# EAGLE design AD_IanFritz (EAGLE 9.6.2)
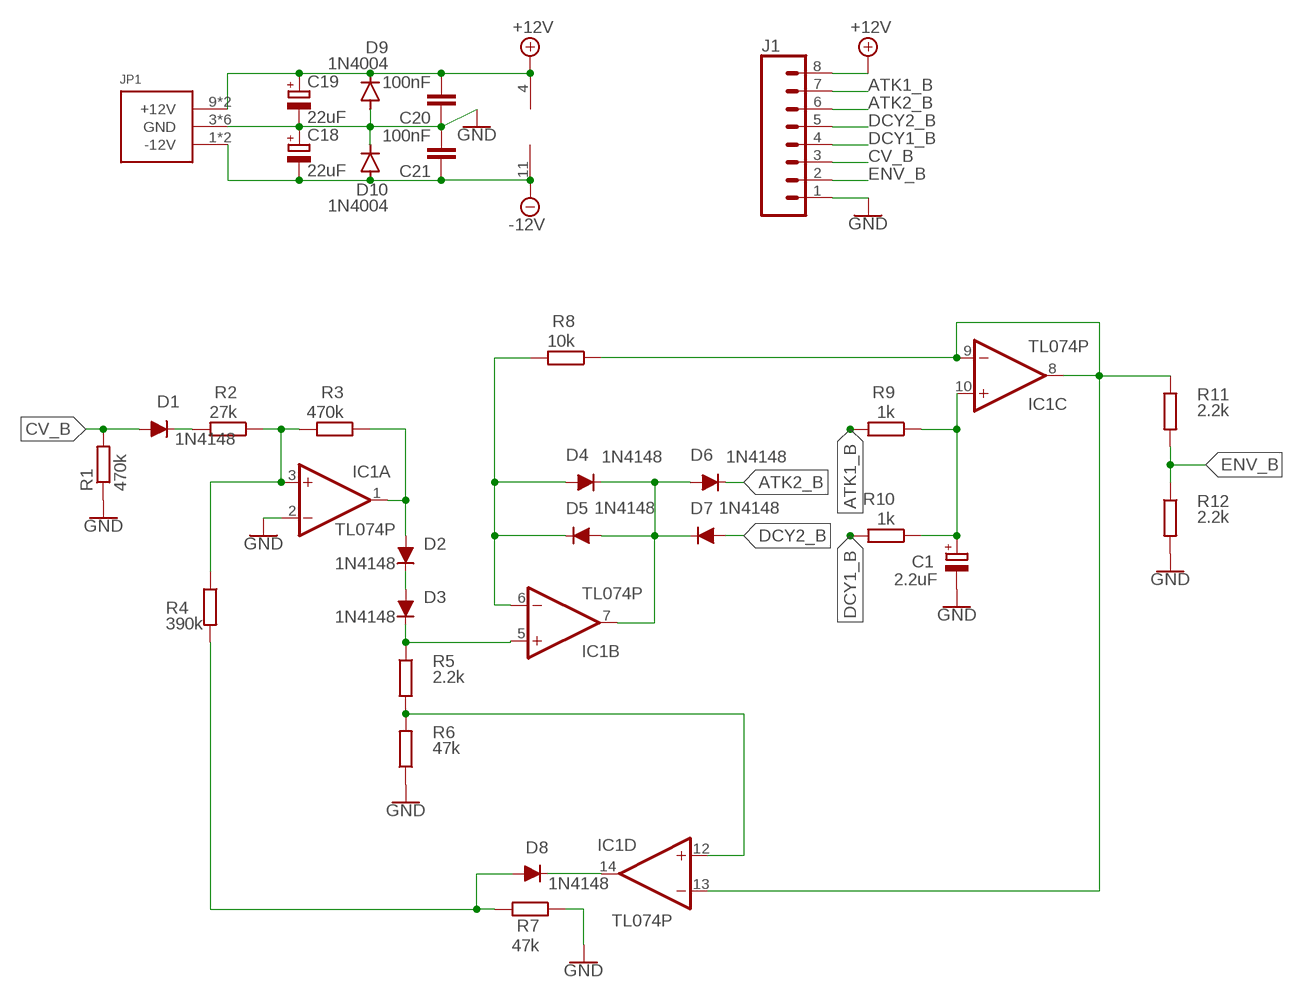
[diagram p0: schematic, sheet 1]

## Parts
C1  2.2uF  CPOL-EUE2-4  [E2-4]
C18  22uF  CPOL-EUE2-4  [E2-4]
C19  22uF  CPOL-EUE2-4  [E2-4]
C20  100nF  C2,5-3  [C2.5-3]
C21  100nF  C2,5-3  [C2.5-3]
D1  1N4148  DIODED0-35  [DO-35]
D2  1N4148  DIODED0-35  [DO-35]
D3  1N4148  DIODED0-35  [DO-35]
D4  1N4148  DIODED0-35  [DO-35]
D5  1N4148  DIODED0-35  [DO-35]
D6  1N4148  DIODED0-35  [DO-35]
D7  1N4148  DIODED0-35  [DO-35]
D8  1N4148  DIODED0-35  [DO-35]
D9  1N4004  [DO41-10]
D10  1N4004  [DO41-10]
IC1  TL074P  [DIL14]
J1  CONN_08"  [1X08]
JP1  POWER_SIMPLE10  [POWER_10]
R1  470k  RESISTOR7MM  [7MM_RESISTOR]
R2  27k  RESISTOR7MM  [7MM_RESISTOR]
R3  470k  RESISTOR7MM  [7MM_RESISTOR]
R4  390k  RESISTOR7MM  [7MM_RESISTOR]
R5  2.2k  RESISTOR7MM  [7MM_RESISTOR]
R6  47k  RESISTOR7MM  [7MM_RESISTOR]
R7  47k  RESISTOR7MM  [7MM_RESISTOR]
R8  10k  RESISTOR7MM  [7MM_RESISTOR]
R9  1k  RESISTOR7MM  [7MM_RESISTOR]
R10  1k  RESISTOR7MM  [7MM_RESISTOR]
R11  2.2k  RESISTOR7MM  [7MM_RESISTOR]
R12  2.2k  RESISTOR7MM  [7MM_RESISTOR]

## Nets
+12V [power]: C19.+ C20.2 D9.C IC1.4(P:V+) J1.8 JP1.9(+12V) JP1.10(+12V)
-12V [power]: C18.- C21.1 D10.A IC1.11(P:V-) JP1.1(-12V) JP1.2(-12V)
ATK1_B: J1.7 R9.2
ATK2_B: D6.C J1.6
CV_B: D1.A J1.3 R1.2
DCY1_B: J1.4 R10.2
DCY2_B: D7.A J1.5
ENV_B: J1.2 R11.2 R12.1
GND: C1.- C18.+ C19.- C20.1 C21.2 D9.A D10.C IC1.2(A:-IN) J1.1 JP1.3(GND) JP1.4(GND) JP1.5(GND) JP1.6(GND) JP1.7(GND) JP1.8(GND) R1.1 R6.1 R7.1 R12.2
N$1: D3.C IC1.5(B:+IN) R5.1
N$2: D1.C R2.2
N$3: IC1.3(A:+IN) R2.1 R3.2 R4.1
N$6: D2.A IC1.1(A:OUT) R3.1
N$7: D2.C D3.A
N$9: IC1.12(D:+IN) R5.2 R6.2
N$10: D4.A D5.C IC1.6(B:-IN) R8.2
N$12: D4.C D5.A D6.A D7.C IC1.7(B:OUT)
N$14: D8.A R4.2 R7.2
N$15: D8.C IC1.14(D:OUT)
N$16: IC1.8(C:OUT) IC1.9(C:-IN) IC1.13(D:-IN) R8.1 R11.1
N$19: C1.+ IC1.10(C:+IN) R9.1 R10.1

## Library data of the parts
C1 C18 C19 = rcl:CPOL-EU: POLARIZED CAPACITOR, European symbol; SPICEPREFIX: C
C20 C21 = capacitor-wima:C: CAPACITOR naming: grid - package width
D1-D8 = x0x_pacemaker:DIODE
D9 D10 = diode:1N4004: DIODE general purpose rectifier, 1 A
IC1 = linear:TL074: OP AMP
J1 = SparkFun-Connectors:CONN_08: Multi connection point. Often used as Generic Header-pin footprint for 0.1 inch spaced/style header connections On any of the 0.1 inch spaced packages, you can populate with these: Break Away Headers - Straight <https://www.sparkfun.com/products/116> (PRT-00116) Break Away Male Headers - Right Angle <https://www.sparkfun.com/products/553> (PRT-00553) Female Headers <https://www.sparkfun.com/products/115> (PRT-00115) Break Away Headers - Machine Pin <https://www.sparkfun.com/products/117> (PRT-00117) Break Away Female Headers - Swiss Machine Pin <https://www.sparkfun.com/products/743> (PRT-00743) Arduino Stackable Header - 8 Pin <https://www.sparkfun.com/products/9279> (PRT-09279) For SCREWTERMINALS and SPRING TERMINALS visit here: Screw Terimnals on SparkFun.com <https://www.sparkfun.com/search/results?term=Screw+Terminals> (5mm/3.5mm/2.54mm spacing) This device is also useful as a general connection point to wire up your design to another part of your project. Our various solder wires solder well into these plated through hole pads. Hook-Up Wire - Assortment (Stranded, 22 AWG) <https://www.sparkfun.com/products/11375> (PRT-11375) Hook-Up Wire - Assortment (Solid Core, 22 AWG) <https://www.sparkfun.com/products/11367> (PRT-11367) View the entire wire category on our website here <https://www.sparkfun.com/categories/141> Special notes: Molex polarized connector foot print use with SKU : PRT-08231 with associated crimp pins and housings. 1MM SMD Version SKU: PRT-10208 NOTES ON THE VARIANTS LOCK and LOCK_LONGPADS... This footprint was designed to help hold the alignment of a through-hole component (i.e. 6-pin header) while soldering it into place. You may notice that each hole has been shifted either up or down by 0.005 of an inch from it's more standard position (which is a perfectly straight line). This slight alteration caused the pins (the squares in the middle) to touch the edges of the holes. Because they are alternating, it causes a "brace" to hold the component in place. 0.005 has proven to be the perfect amount of "off-center" position when using our standard breakaway headers. Although looks a little odd when you look at the bare footprint, once you have a header in there, the alteration is very hard to notice. Also,if you push a header all the way into place, it is covered up entirely on the bottom side.; PROD_ID: CONN-08438
JP1 = russ_eurorack:POWER_SIMPLE
R1-R12 = MusicThingModular:RESISTOR: Standard resistor, various versions

## Net classes
0 default: width 0.203 mm
1 power: width 0.406 mm

## Board
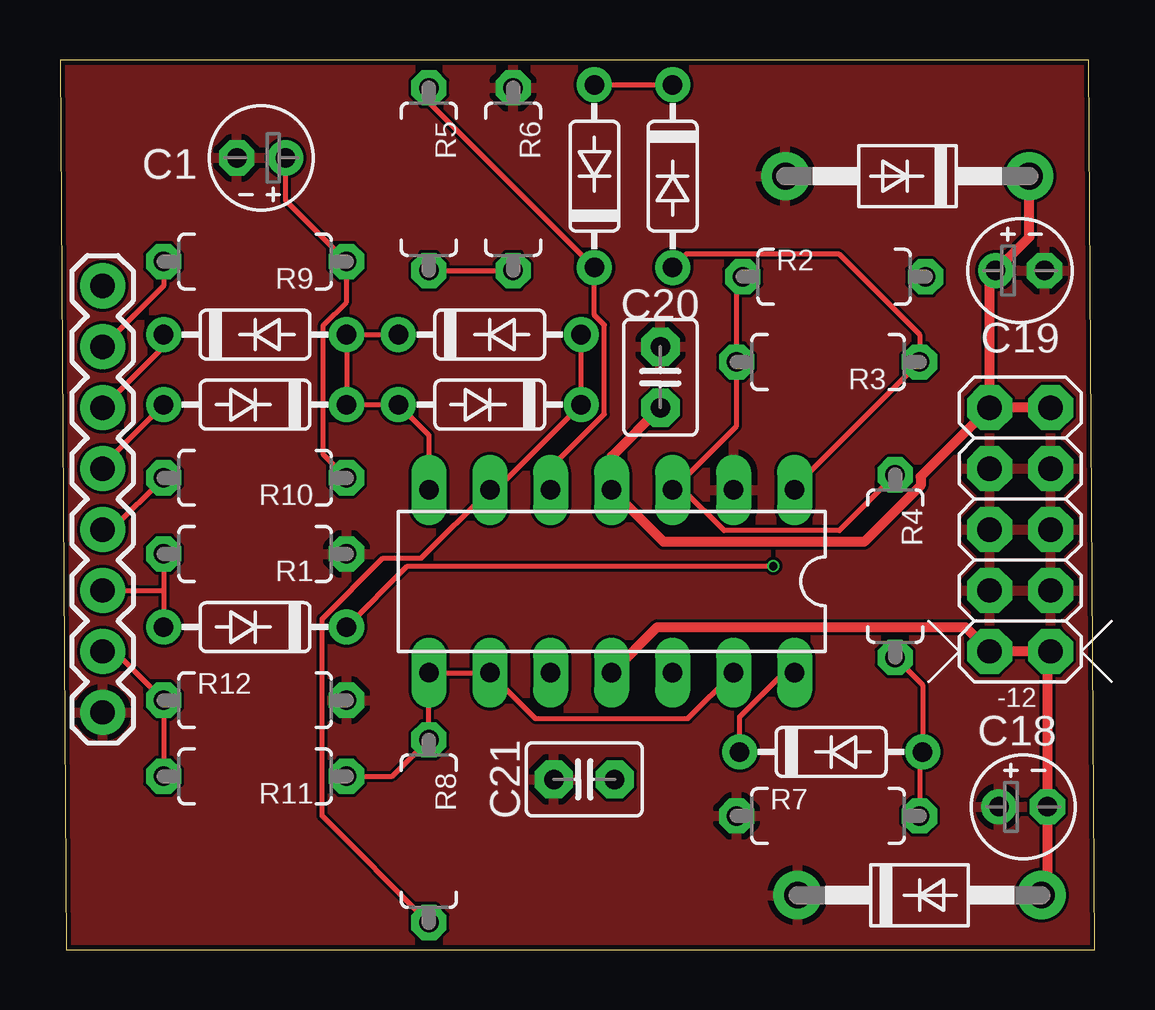
[diagram p1: board, top side]
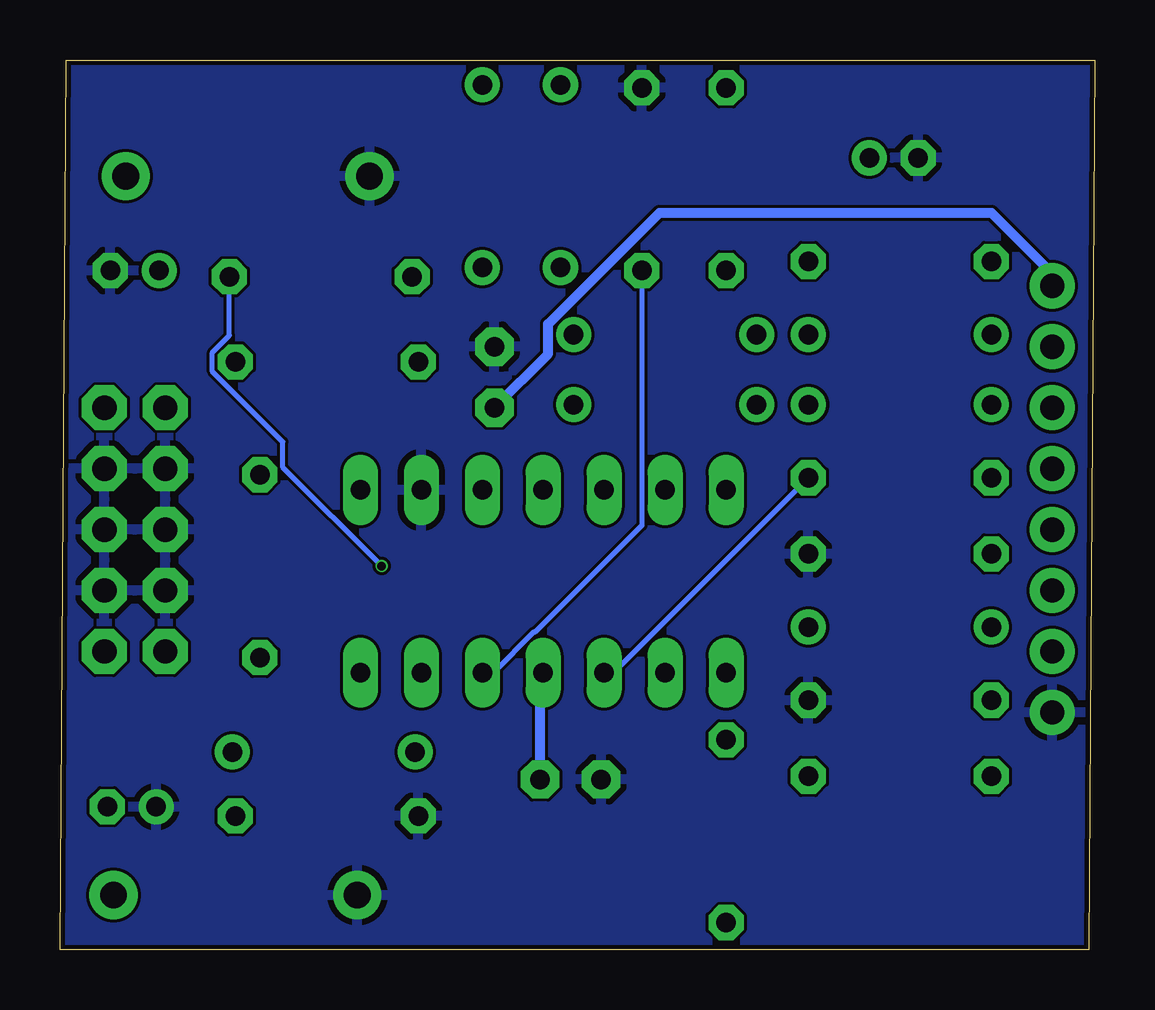
[diagram p2: board, bottom side, seen from below]

Size 43.12 x 37.1 mm. Coordinates in mm from the lower left corner, seen from the top.
Outline: 0.25,0 43.12,0 42.87,37.1 0,37.1 0.25,0
Copper layers (1*16): Top 0.035mm / dielectric 1.6mm / Bottom 0.035mm
Design rules "jlcpcb-2layers": minimum track width 5mil, minimum drill 0.3mm, track to track 5mil, track to pad 5mil, pad to pad 5mil, via to via 5mil, smd to smd 5mil, copper to edge 0.2mm, drill to drill 6mil, minimum pad ring 10mil, minimum via ring 3mil, stop-mask expansion 4mil, vias tented up to drill 0mil, thermal gap 10mil

### Footprints (pad centres in the part's own frame; a part is rotated, then mirrored left to right if it is on the bottom)
E2-4 = drill 0.813 pad 1.27: + -1.016,0 | drill 0.813 pad 1.27 octagon: - 1.016,0
C2.5-3 = drill 0.813 pad 1.6 octagon: 1 -1.27,0; 2 1.27,0
DO-35 = drill 0.813 pad 1.321: A 3.81,0; C -3.81,0
DO41-10 = drill 1.118: A 5.08,0; C -5.08,0
DIL14 = drill 0.813 long: 1 -7.62,-3.81; 2 -5.08,-3.81; 3 -2.54,-3.81; 4 0,-3.81; 5 2.54,-3.81; 6 5.08,-3.81; 7 7.62,-3.81; 8 7.62,3.81; 9 5.08,3.81; 10 2.54,3.81; 11 0,3.81; 12 -2.54,3.81; 13 -5.08,3.81; 14 -7.62,3.81
1X08 = drill 1.016 pad 1.88: 1 0,0; 2 2.54,0; 3 5.08,0; 4 7.62,0; 5 10.16,0; 6 12.7,0; 7 15.24,0; 8 17.78,0
POWER_10 = drill 1.016 pad 1.88 octagon: 1 -5.08,-1.27; 2 -5.08,1.27; 3 -2.54,-1.27; 4 -2.54,1.27; 5 0,-1.27; 6 0,1.27; 7 2.54,-1.27; 8 2.54,1.27; 9 5.08,-1.27; 10 5.08,1.27
7MM_RESISTOR = drill 0.813 octagon: 1 -3.81,0; 2 3.81,0

### Placement (x,y rotation side)
C1  8.38,33.02 180 top
C18  40.13,5.97 0 top
C19  40.01,28.32 0 top
C20  25.02,23.88 270 top
C21  21.84,7.11 180 top
D1  8.13,13.46 180 top
D2  25.53,32.26 270 top
D3  22.27,32.26 90 top
D4  17.91,25.65 0 top
D5  17.91,22.73 180 top
D6  8.13,25.65 0 top
D7  8.13,22.73 180 top
D8  32.13,8.25 0 top
D9  35.31,32.26 180 top
D10  35.81,2.29 0 top
IC1  22.99,15.37 180 top
J1  1.78,9.91 90 top
JP1  40.01,17.53 90 top
R1  8.13,16.51 180 top
R2  32.26,28.07 0 top
R3  32,24.51 180 top
R4  34.8,16 270 top
R5  15.37,32.13 270 top
R6  18.88,32.13 270 top
R7  32,5.59 0 top
R8  15.37,4.95 270 top
R9  8.13,28.7 180 top
R10  8.13,19.68 180 top
R11  8.13,7.24 180 top
R12  8.13,10.41 0 top

### Tracks (layer width: path | path; a pad name or v marks a point on that pad's centre or on a via)
+12V
  Top 0.406: C20.2 22.99,20.57 IC1.4 25.15,17.02 33.51,17.02 35.86,19.37 35.86,19.73 JP1.10 | JP1.9 JP1.10 | JP1.10 38.73,28.07 C19.+ 40.39,29.72 D9.C
  Bottom 0.406: C20.2 22.78,24.85 22.78,26.09 18.14,30.73 4.32,30.73 1.78,28.19 J1.8
-12V
  Top 0.406: IC1.11 24.89,13.46 37.72,13.46 JP1.2 JP1.1 41.15,12.32 C18.- 41.15,2.54 D10.A
  Bottom 0.406: C21.1 23.11,11.43 IC1.11
ATK1_B
  Top 0.203: R9.2 4.32,27.69 J1.7
ATK2_B
  Top 0.203: D6.C 4.32,25.15 J1.6
CV_B
  Top 0.203: R1.2 4.32,14.99 | 4.32,14.99 D1.A | J1.3 4.32,14.99
DCY1_B
  Top 0.203: R10.2 2.16,17.53 J1.4
DCY2_B
  Top 0.203: D7.A 1.78,20.19 J1.5
ENV_B
  Top 0.203: J1.2 2.29,12.45 R12.1 R11.2
GND
  pour Top: -2.79,42.67 45.47,42.67 45.47,-3.56 -2.79,-3.56
  pour Bottom: -3.81,41.66 45.21,41.66 45.21,-3.05 -3.81,-3.05
N$1
  Top 0.203: IC1.5 20.45,20.11 22.68,22.33 22.68,26.05 22.27,26.46 D3.C 15.37,35.35 R5.1
N$2  (via drill 0.35)
  Top 0.203: D1.C 14.48,16 v29.72,16
  Bottom 0.203: v29.72,16 33.84,20.12 33.84,21.18 36.77,24.11 36.77,24.91 36.07,25.61 R2.2
N$3
  Top 0.203: R2.1 28.19,27.81 R3.2 28.19,21.84 IC1.3 25.98,19.18 27.67,17.49 32.47,17.49 R4.1
N$6
  Top 0.203: IC1.1 30.61,19.3 R3.1 35.81,25.65 32.44,29.03 26.11,29.03 D2.A
N$7
  Top 0.203: D3.A D2.C
N$9
  Top 0.203: R5.2 R6.2
  Bottom 0.203: R6.2 18.88,17.7 23.33,13.25 23.39,13.25 25.08,11.56 IC1.12
N$10
  Top 0.203: D5.C D4.A D5.C | D5.C 18.16,19.18 IC1.6 15.06,16.33 13.45,16.33 10.92,13.8 10.92,5.59 R8.2
N$12
  Top 0.203: D4.C D6.A D7.C D5.A 15.37,21.46 IC1.7
N$14
  Top 0.203: R4.2 35.94,11.05 D8.A 35.81,8.13 R7.2
N$15
  Top 0.203: D8.C 28.32,9.72 30.16,11.56 IC1.14
N$16
  Top 0.203: R11.1 13.84,7.24 R8.1 IC1.8 IC1.9 19.81,9.65 26.16,9.65 IC1.13
N$19
  Top 0.203: R9.1 | R9.1 9.4,31.24 C1.+ | R9.1 11.94,27.01 10.98,26.05 10.98,20.64 R10.1
  Bottom 0.203: R10.1 20.07,11.56 IC1.10